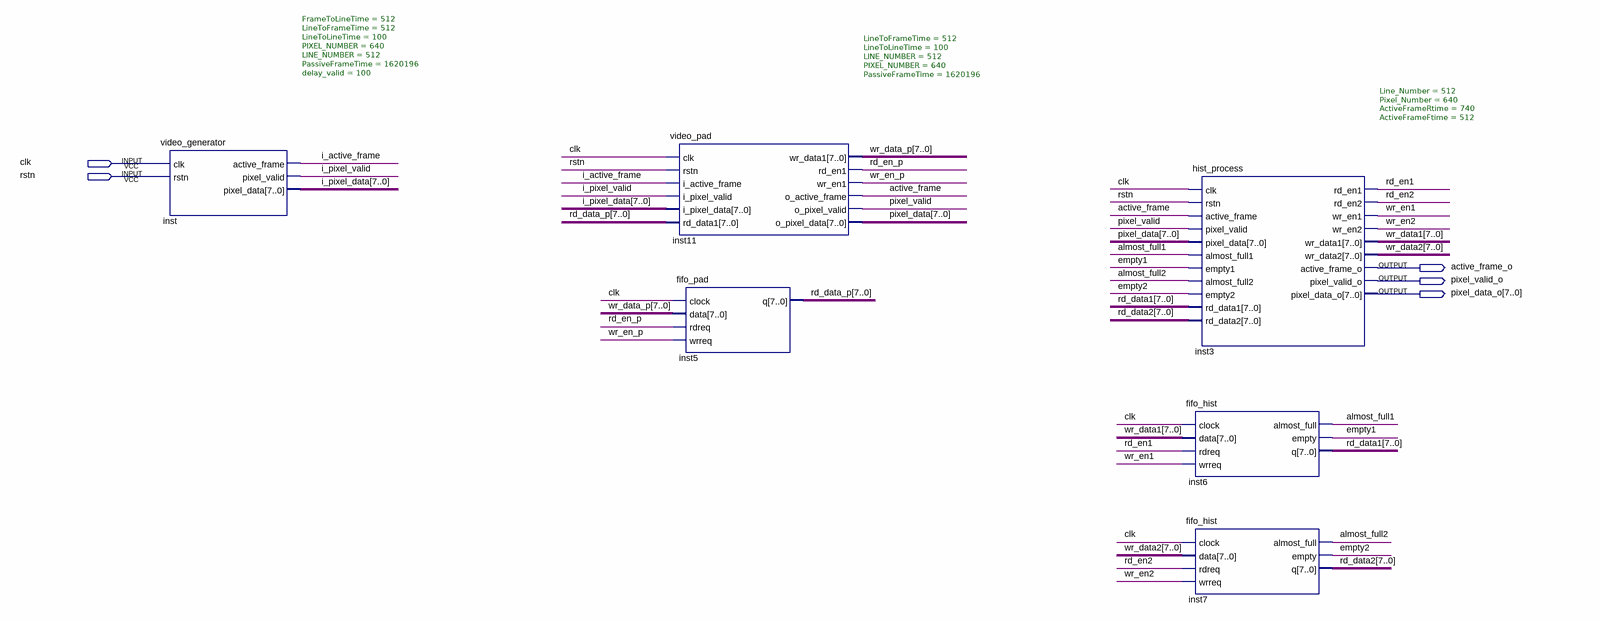
[diagram p0: schematic sheet]
// Quartus schematic filter_with_padding_top.bdf as structural Verilog: 6 symbols, 5 pins
module filter_with_padding_top (
  input  clk,
  input  rstn,
  output active_frame_o,
  output pixel_valid_o,
  output [7:0] pixel_data_o
);

  wire active_frame, almost_full1, almost_full2, empty1, empty2, i_active_frame, i_pixel_valid, pixel_valid,
       rd_en1, rd_en2, rd_en_p, wr_en1, wr_en2, wr_en_p;
  wire [7:0] i_pixel_data, pixel_data, rd_data1, rd_data2, rd_data_p, wr_data1, wr_data2, wr_data_p;

  video_generator #(.FrameToLineTime(512), .LineToFrameTime(512), .LineToLineTime(100), .PIXEL_NUMBER(640), .LINE_NUMBER(512), .PassiveFrameTime(1620196), .delay_valid(100)) inst (
    .clk(clk), .rstn(rstn), .active_frame(i_active_frame), .pixel_valid(i_pixel_valid),
    .pixel_data(i_pixel_data));
  video_pad #(.LineToFrameTime(512), .LineToLineTime(100), .LINE_NUMBER(512), .PIXEL_NUMBER(640), .PassiveFrameTime(1620196)) inst11 (
    .clk(clk), .rstn(rstn), .i_active_frame(i_active_frame), .i_pixel_valid(i_pixel_valid),
    .i_pixel_data(i_pixel_data), .rd_data1(rd_data_p), .wr_data1(wr_data_p), .rd_en1(rd_en_p),
    .wr_en1(wr_en_p), .o_active_frame(active_frame), .o_pixel_valid(pixel_valid), .o_pixel_data(pixel_data));
  fifo_pad inst5 (.clock(clk), .data(wr_data_p), .rdreq(rd_en_p), .wrreq(wr_en_p), .q(rd_data_p));
  hist_process #(.Line_Number(512), .Pixel_Number(640), .ActiveFrameRtime(740), .ActiveFrameFtime(512)) inst3 (
    .clk(clk), .rstn(rstn), .active_frame(active_frame), .pixel_valid(pixel_valid), .pixel_data(pixel_data),
    .almost_full1(almost_full1), .empty1(empty1), .almost_full2(almost_full2), .empty2(empty2),
    .rd_data1(rd_data1), .rd_data2(rd_data2), .rd_en1(rd_en1), .rd_en2(rd_en2), .wr_en1(wr_en1),
    .wr_en2(wr_en2), .wr_data1(wr_data1), .wr_data2(wr_data2), .active_frame_o(active_frame_o),
    .pixel_valid_o(pixel_valid_o), .pixel_data_o(pixel_data_o));
  fifo_hist inst6 (
    .clock(clk), .data(wr_data1), .rdreq(rd_en1), .wrreq(wr_en1), .almost_full(almost_full1), .empty(empty1),
    .q(rd_data1));
  fifo_hist inst7 (
    .clock(clk), .data(wr_data2), .rdreq(rd_en2), .wrreq(wr_en2), .almost_full(almost_full2), .empty(empty2),
    .q(rd_data2));
endmodule
